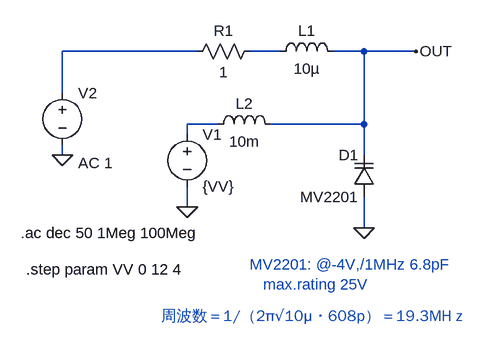
[diagram p0: schematic Fig_2-124_VARACTOR.asc]
Fig_2-124_VARACTOR.asc, the LTspice schematic file:
Version 4
SHEET 1 924 680
WIRE 64 -16 -144 -16
WIRE 192 -16 144 -16
WIRE 320 -16 272 -16
WIRE 400 -16 320 -16
WIRE -144 48 -144 -16
WIRE 96 96 48 96
WIRE 320 96 320 -16
WIRE 320 96 176 96
WIRE 48 112 48 96
WIRE -144 144 -144 128
WIRE 320 144 320 96
WIRE 48 224 48 192
WIRE 320 256 320 208
FLAG 48 224 0
FLAG 320 256 0
FLAG -144 144 0
FLAG 400 -16 OUT
SYMBOL ind 176 0 R270
WINDOW 0 32 56 VTop 2
WINDOW 3 5 56 VBottom 2
SYMATTR InstName L1
SYMATTR Value 10µ
SYMBOL ind 80 112 R270
WINDOW 0 32 56 VTop 2
WINDOW 3 5 56 VBottom 2
SYMATTR InstName L2
SYMATTR Value 10m
SYMBOL voltage 48 96 R0
WINDOW 123 0 0 Left 2
WINDOW 39 0 0 Left 2
SYMATTR InstName V1
SYMATTR Value {VV}
SYMBOL voltage -144 32 R0
WINDOW 123 24 124 Left 2
WINDOW 39 24 152 Left 2
SYMATTR Value2 AC 1
SYMATTR InstName V2
SYMATTR Value ""
SYMBOL varactor 336 208 R180
WINDOW 0 24 64 Left 2
WINDOW 3 24 0 Left 2
SYMATTR InstName D1
SYMATTR Value MV2201
SYMBOL res 48 0 R270
WINDOW 0 32 56 VTop 2
WINDOW 3 0 56 VBottom 2
SYMATTR InstName R1
SYMATTR Value 1
TEXT 144 312 Left 2 ;MV2201: @-4V,/1MHz 6.8pF\n   max.rating 25V
TEXT -208 264 Left 2 !.ac dec 50 1Meg 100Meg
TEXT -200 320 Left 2 !.step param VV 0 12 4
TEXT 8 392 Left 2 ;周波数＝1/（2π√10μ・608p）＝19.3MHｚ

The netlist it stands for:
* Fig_2-124_VARACTOR.asc
L1 N002 OUT 10µ
L2 N003 OUT 10m
V1 N003 0 {VV}
V2 N001 0 AC 1
D1 0 OUT MV2201
R1 N001 N002 1
.model D D
.lib standard.dio
* MV2201: @-4V,/1MHz 6.8pF
*    max.rating 25V
.ac dec 50 1Meg 100Meg
.step param VV 0 12 4
* 周波数＝1/（2π√10μ・608p）＝19.3MHｚ
.backanno
.end